# Altium project MJVESC_MINI.PrjPCB
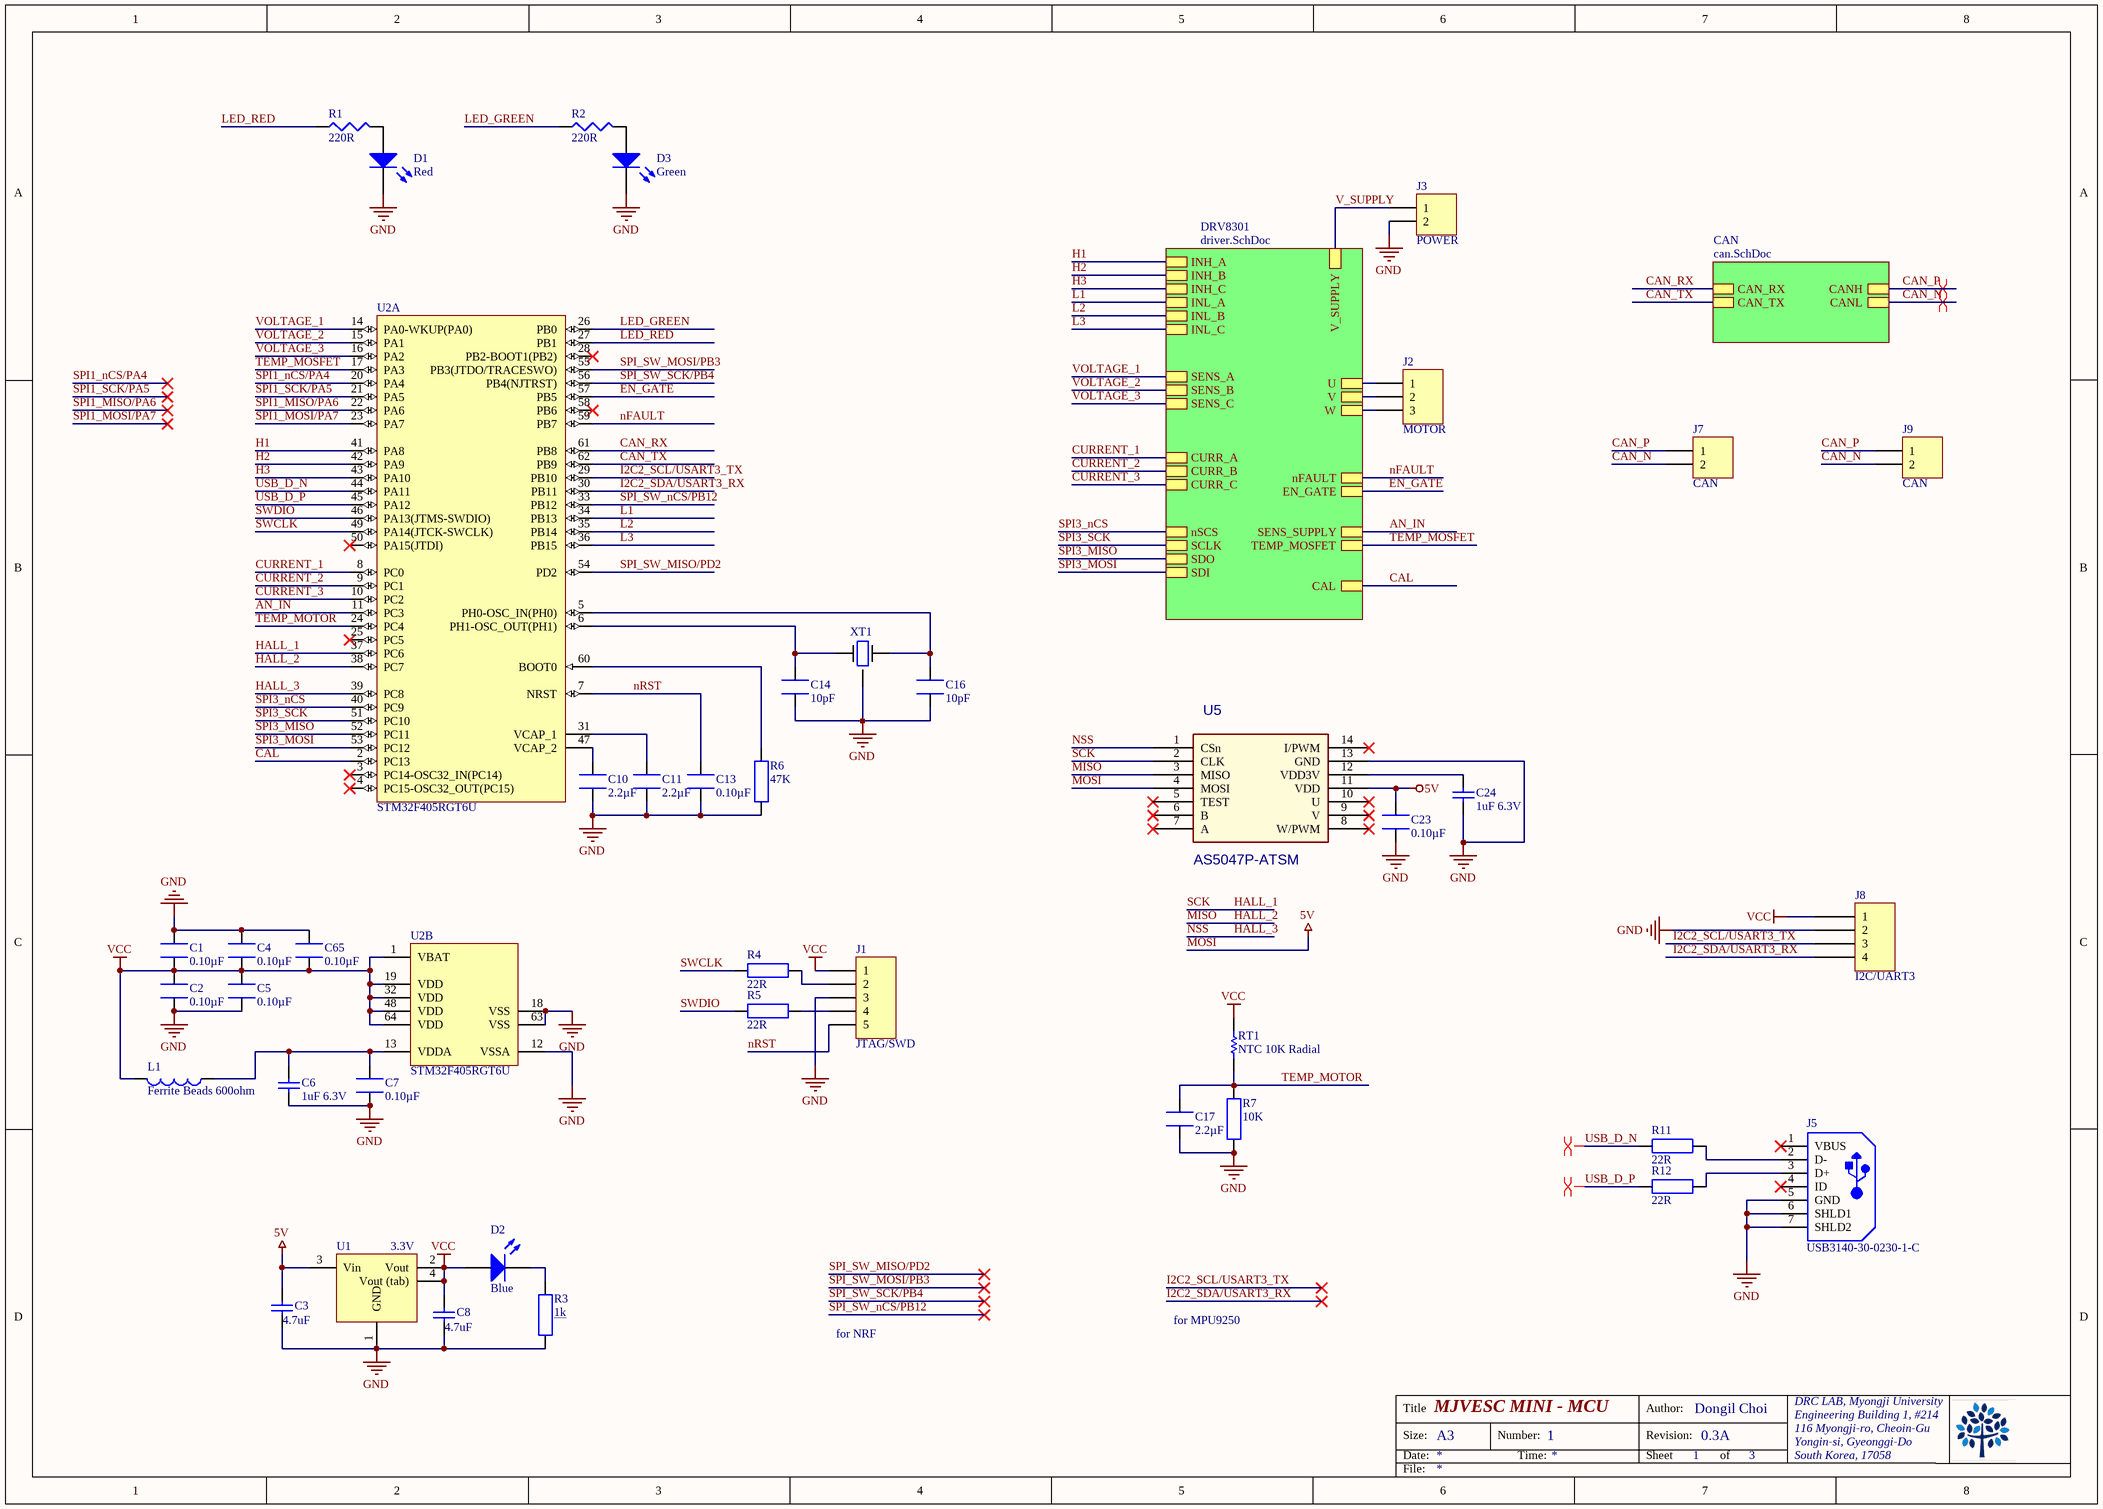
[diagram p0: mcu.SchDoc]
3 sheets, 121 parts. Net scope: hierarchical (ports join the sheet entries above them; power ports are global).
Board file: MJVESC_MINI_CIR_VER03.PcbDoc
Sheets:
  mcu.SchDoc
    CAN = can.SchDoc
    DRV8301 = driver.SchDoc

## Sheet mcu.SchDoc: MJVESC MINI - MCU
size A3; Author: Dongil Choi; Organization: DRC LAB, Myongji University; Address1: Engineering Building 1, #214; Address2: 116 Myongji-ro, Cheoin-Gu; Address3: Yongin-si, Gyeonggi-Do; Address4: South Korea, 17058; DocumentNumber: 1; Revision: 0.3A; SheetNumber: 1; SheetTotal: 3

### Parts
C1  0.10µF  [CAP 0603/1608]
C2  0.10µF  [CAP 0603/1608]
C3  4.7uF  [CAPC0805(2012)145_N]
C4  0.10µF  [CAP 0603/1608]
C5  0.10µF  [CAP 0603/1608]
C6  1uF 6.3V  [CAPC0603(1608)100_N]
C7  0.10µF  [CAP 0603/1608]
C8  4.7uF  [CAPC0805(2012)145_N]
C10  2.2µF  [CAP 0603/1608]
C11  2.2µF  [CAP 0603/1608]
C13  0.10µF  [CAP 0603/1608]
C14  10pF  [CAP 0603/1608]
C16  10pF  [CAP 0603/1608]
C17  2.2µF  [CAP 0603/1608]
C23  0.10µF  [CAP 0603/1608]
C24  1uF 6.3V  [CAPC0603(1608)100_N]
C65  0.10µF  [CAP 0603/1608]
D1  Red  [LED 0603/1608 RED]
D2  Blue  [LED 0603/1608 BLUE]
D3  Green  [LED 0603/1608 GREEN]
J1  JTAG/SWD  [JST BM05B-GHS-TBT]
J2  MOTOR  [MR30PW - MIRROR]
J3  POWER  [XT30PW - MIRROR]
J5  USB3140-30-0230-1-C  [GCT-USB3140_V]
J7  CAN  [JST SM02B-GHS-TB]
J8  I2C/UART3  [JST BM04B-GHS-TBT]
J9  CAN  [JST SM02B-GHS-TB]
L1  Ferrite Beads 600ohm  [FER 0603/1608]
R1  220R  [RES 0603/1608]
R2  220R  [RES 0603/1608]
R3  1k  [RES 0603/1608]
R4  22R  [RES 0603/1608]
R5  22R  [RES 0603/1608]
R6  47K  [RES 0603/1608]
R7  10K  [RES 0603/1608]
R11  22R  [RES 0603/1608]
R12  22R  [RES 0603/1608]
RT1  NTC 10K Radial  [SEMI-103AT-2_V]
U1  3.3V  [SOT-223-2]
U2  STM32F405RGT6U  [STM-LQFP64_V]  (parts A,B of 2)
U5  AS5047P-ATSM  [AMS-TSSOP-14-5000X4400DE_M]
XT1  8 MHz  [DFN220P320X110-4N]  (value not drawn)

### Sub-sheets
CAN = can.SchDoc: CAN_TX, CAN_RX, CANH, CANL
DRV8301 = driver.SchDoc: EN_GATE, SENS_A, SENS_B, INH_A, INL_A, INH_B, INL_B, INH_C, INL_C, SENS_C, SENS_SUPPLY, CURR_C, CURR_B, CURR_A, U, V, W, V_SUPPLY, nSCS, SCLK, SDO, SDI, nFAULT, TEMP_MOSFET, CAL

### Nets
GND: C1.1 C2.2 C3.1 C4.1 C5.2 C6.2 C7.2 C8.1 C10.1 C11.1 C13.1 C14.2 C16.2 C17.1 C23.1 C24.2 C65.1 D1.2(K) D3.2(K) J1.3 J3.2 J5.5(GND) J5.6(SHLD1) J5.7(SHLD2) J8.2 R3.2 R6.1 R7.2 U1.1(GND) U2.12(VSSA) U2.18(VSS) U2.63(VSS) U5.13(GND) XT1.G
MOSI: C3.2 C23.2 U1.3(Vin) U5.4(MOSI) U5.11(VDD)  [also labelled 5V]
V_SUPPLY: J3.1 ; sheet DRV8301/V_SUPPLY
VCC: C1.2 C2.1 C4.2 C5.1 C8.2 C65.2 D2.1(A) J1.1 J8.1 L1.2 RT1.2 U1.2(Vout) U1.4(Vout_(tab)) U2.1(VBAT) U2.19(VDD) U2.32(VDD) U2.48(VDD) U2.64(VDD)
AN_IN: U2.11(PC3) ; sheet DRV8301/SENS_SUPPLY
CAL: U2.2(PC13) ; sheet DRV8301/CAL
CAN_N: J7.2 J9.2 ; sheet CAN/CANL
CAN_P: J7.1 J9.1 ; sheet CAN/CANH
CAN_RX: U2.61(PB8) ; sheet CAN/CAN_RX
CAN_TX: U2.62(PB9) ; sheet CAN/CAN_TX
CURRENT_1: U2.8(PC0) ; sheet DRV8301/CURR_A
CURRENT_2: U2.9(PC1) ; sheet DRV8301/CURR_B
CURRENT_3: U2.10(PC2) ; sheet DRV8301/CURR_C
EN_GATE: U2.57(PB5) ; sheet DRV8301/EN_GATE
H1: U2.41(PA8) ; sheet DRV8301/INH_A
H2: U2.42(PA9) ; sheet DRV8301/INH_B
H3: U2.43(PA10) ; sheet DRV8301/INH_C
HALL_1: U2.37(PC6) U5.2(CLK)  [also labelled SCK]
HALL_2: U2.38(PC7) U5.3(MISO)  [also labelled MISO]
HALL_3: U2.39(PC8) U5.1(CSn)  [also labelled NSS]
I2C2_SCL/USART3_TX: J8.3 U2.29(PB10)
I2C2_SDA/USART3_RX: J8.4 U2.30(PB11)
L1: U2.34(PB13) ; sheet DRV8301/INL_A
L2: U2.35(PB14) ; sheet DRV8301/INL_B
L3: U2.36(PB15) ; sheet DRV8301/INL_C
LED_GREEN: R2.1 U2.26(PB0)
LED_RED: R1.1 U2.27(PB1)
nFAULT: U2.59(PB7) ; sheet DRV8301/nFAULT
nRST: C13.2 J1.5 U2.7(NRST)
SHA: J2.1 ; sheet DRV8301/U
SHB: J2.2 ; sheet DRV8301/V
SHC: J2.3 ; sheet DRV8301/W
SPI1_MISO/PA6: U2.22(PA6)
SPI1_MOSI/PA7: U2.23(PA7)
SPI1_nCS/PA4: U2.20(PA4)
SPI1_SCK/PA5: U2.21(PA5)
SPI3_MISO: U2.52(PC11) ; sheet DRV8301/SDO
SPI3_MOSI: U2.53(PC12) ; sheet DRV8301/SDI
SPI3_nCS: U2.40(PC9) ; sheet DRV8301/nSCS
SPI3_SCK: U2.51(PC10) ; sheet DRV8301/SCLK
SPI_SW_MISO/PD2: U2.54(PD2)
SPI_SW_MOSI/PB3: U2.55(PB3(JTDO/TRACESWO))
SPI_SW_nCS/PB12: U2.33(PB12)
SPI_SW_SCK/PB4: U2.56(PB4(NJTRST))
SWCLK: R4.2 U2.49(PA14(JTCK-SWCLK))
SWDIO: R5.2 U2.46(PA13(JTMS-SWDIO))
TEMP_MOSFET: U2.17(PA3) ; sheet DRV8301/TEMP_MOSFET
TEMP_MOTOR: C17.2 R7.1 RT1.1 U2.24(PC4)
USB_D_N: R11.1 U2.44(PA11)
USB_D_P: R12.1 U2.45(PA12)
VOLTAGE_1: U2.14(PA0-WKUP(PA0)) ; sheet DRV8301/SENS_A
VOLTAGE_2: U2.15(PA1) ; sheet DRV8301/SENS_B
VOLTAGE_3: U2.16(PA2) ; sheet DRV8301/SENS_C
NetC6_1: C6.1 C7.1 L1.1 U2.13(VDDA)
NetC10_2: C10.2 U2.47(VCAP_2)
NetC11_2: C11.2 U2.31(VCAP_1)
NetC14_1: C14.1 U2.6(PH1-OSC_OUT(PH1)) XT1.1
NetC16_1: C16.1 U2.5(PH0-OSC_IN(PH0)) XT1.3
NetC24_1: C24.1 U5.12(VDD3V)
NetD1_1: D1.1(A) R1.2
NetD2_2: D2.2(K) R3.1
NetD3_1: D3.1(A) R2.2
NetJ1_2: J1.2 R4.1
NetJ1_4: J1.4 R5.1
NetJ5_2: J5.2(D-) R11.2
NetJ5_3: J5.3(D+) R12.2
NetR6_2: R6.2 U2.60(BOOT0)

Not connected (* = marked no-connect by the designer): J5 1(VBUS)* 4(ID)*; U2 3(PC14-OSC32_IN(PC14))* 4(PC15-OSC32_OUT(PC15))* 25(PC5)* 28(PB2-BOOT1(PB2))* 50(PA15(JTDI))* 58(PB6)*; U5 5(TEST)* 6(B)* 7(A)* 8(W/PWM)* 9(V)* 10(U)* 14(I/PWM)*

### Layout directives
differential pair: CAN_N, CAN_P, USB_D_N, USB_D_P

### Notes on the sheet
- for MPU9250
- for NRF
- Title
- Size:
- Date:
- A3
- Number:
- Time:
- Revision:
- Sheet
- Author:
- of
- File:

### Library data of the parts
C1 C2 C4 C5 C7 C13 C23 C65 = GRM188R71E104KA01D: CAP CER 0.1UF 25V X7R 0603; Manufacturer: Murata Electronics North America; Tolerance: ±10%; Supplier 1: Digi-Key; Supplier Part Number 1: 490-1524-1-ND; Manufacturer Part Number: GRM188R71E104KA01D; RoHS: RoHS Compliant; Category: Capacitors; Stock 1: 1667481; Pricing 1: 1=0.1, 10=0.019, 50=0.0104, 100=0.0088, 250=0.0072, 500=0.00616, 1000=0.0048 (USD); Packaging: Cut Tape (CT); Capacitance: 0.10µF; Voltage - Rated: 25V; Temperature Coefficient: X7R; Mounting Type: Surface Mount, MLCC; Operating Temperature: -55°C ~ 125°C; Applications: General Purpose; Ratings: -; Package / Case: 0603 (1608 Metric); Size / Dimension: 0.063" L x 0.031" W (1.60mm x 0.80mm); Height - Seated (Max): -; Thickness (Max): 0.035" (0.90mm); Lead Spacing: -; Features: -; Lead Style: -; ComponentLink1URL: http://www.murata.com/~/media/webrenewal/support/library/catalog/products/capacitor/mlcc/c02e.pdf; ComponentLink1Description: http://www.murata.com/~/media/webrenewal/support/library/catalog/products/capacitor/mlcc/c02e.pdf; PartNumber: GRM188R71E104KA01D
C3 C8 = CMP-1036-04898-1: CAP 4.7uF 35V ±10% 0805 (2012 Metric) Thickness 1.45mm SMD; PartNumber: GRM219R6YA475KA73D; Case-Metric: 2012; Tolerance: Â±10%; Case-EIA: 0805; Max Thickness: 1.45 mm; Technology: SMT; Value: 4.7uF; Rated Voltage: 35 V
C6 C24 = CMP-1035-02730-1: CAP 1uF 6.3V ±10% 0603 (1608 Metric) Thickness 1mm SMD; PartNumber: CC0603KRX7R5BB105; Case-EIA: 0603; Case-Metric: 1608; Tolerance: Â±10%; Rated Voltage: 6.3 V; Max Thickness: 1 mm; Technology: SMT; Value: 1uF
C10 C11 C17 = GRM188R61C225KE15D: CAP CER 2.2UF 16V X5R 0603; Manufacturer: Murata Electronics North America; Tolerance: ±10%; Supplier 1: Digi-Key; Supplier Part Number 1: 490-3296-1-ND; Manufacturer Part Number: GRM188R61C225KE15D; RoHS: RoHS Compliant; Category: Capacitors; Stock 1: 1255740; Pricing 1: 1=0.12, 10=0.08, 50=0.046, 100=0.038, 250=0.032, 500=0.0268, 1000=0.022 (USD); Packaging: Cut Tape (CT); Capacitance: 2.2µF; Voltage - Rated: 16V; Temperature Coefficient: X5R; Mounting Type: Surface Mount, MLCC; Operating Temperature: -55°C ~ 85°C; Applications: General Purpose; Ratings: -; Package / Case: 0603 (1608 Metric); Size / Dimension: 0.063" L x 0.031" W (1.60mm x 0.80mm); Height - Seated (Max): -; Thickness (Max): 0.035" (0.90mm); Lead Spacing: -; Features: -; Lead Style: -; ComponentLink1URL: http://www.murata.com/~/media/webrenewal/support/library/catalog/products/capacitor/mlcc/c02e.pdf; ComponentLink1Description: http://www.murata.com/~/media/webrenewal/support/library/catalog/products/capacitor/mlcc/c02e.pdf; PartNumber: GRM188R61C225KE15D
C14 C16 = GRM1885C1H100JA01D: CAP CER 10PF 50V NP0 0603; Manufacturer: Murata Electronics North America; Tolerance: ±5%; Temperature Coefficient: C0G, NP0; Supplier 1: Digi-Key; Supplier Part Number 1: 490-1403-1-ND; Manufacturer Part Number: GRM1885C1H100JA01D; RoHS: RoHS Compliant; Category: Capacitors; Stock 1: 450321; Pricing 1: 1=0.1, 10=0.041, 50=0.0222, 100=0.0187, 250=0.01532, 500=0.0131, 1000=0.0102 (USD); Packaging: Cut Tape (CT); Capacitance: 10pF; Voltage - Rated: 50V; Mounting Type: Surface Mount, MLCC; Operating Temperature: -55°C ~ 125°C; Applications: General Purpose; Ratings: -; Package / Case: 0603 (1608 Metric); Size / Dimension: 0.063" L x 0.031" W (1.60mm x 0.80mm); Height - Seated (Max): -; Thickness (Max): 0.035" (0.90mm); Lead Spacing: -; Features: -; Lead Style: -; ComponentLink1URL: http://www.murata.com/~/media/webrenewal/support/library/catalog/products/capacitor/mlcc/c02e.pdf; ComponentLink1Description: http://www.murata.com/~/media/webrenewal/support/library/catalog/products/capacitor/mlcc/c02e.pdf; PartNumber: GRM1885C1H100JA01D
D1 = LED0: Typical INFRARED GaAs LED; PartNumber: LTST-C191KRKT; Published: 8-Jun-2000; LatestRevisionDate: 08-Jul-2005; LatestRevisionNote: Mech Layer 1 removed.; PackageReference: LED-0; Publisher: Altium Limited; PackageDescription: LED; 2 Leads
D2 = LED0: Typical INFRARED GaAs LED; PartNumber: LTST-C191TBKT; Published: 8-Jun-2000; LatestRevisionDate: 08-Jul-2005; LatestRevisionNote: Mech Layer 1 removed.; PackageReference: LED-0; Publisher: Altium Limited; PackageDescription: LED; 2 Leads
D3 = LED0: Typical INFRARED GaAs LED; PartNumber: LTST-C191KGKT; Published: 8-Jun-2000; LatestRevisionDate: 08-Jul-2005; LatestRevisionNote: Mech Layer 1 removed.; PackageReference: LED-0; Publisher: Altium Limited; PackageDescription: LED; 2 Leads
J1 = JST BM05B-GHS-TBT: JST GH Connector, 5Pin, Vertical; LatestRevisionDate: 17-Jul-2002; LatestRevisionNote: Re-released for DXP Platform.; Publisher: Altium Limited; PartNumber: BM05B-GHS-TBT
J2 = MR30PW-M: AMASS, MR30,  on PCBs, 30A 500V, UL94V, -20...120°C; Parameter 1: XT30PW-M; LatestRevisionDate: 17-Jul-2002; LatestRevisionNote: Re-released for DXP Platform.; Publisher: Altium Limited
J3 = XT30PW-M: AMASS, XT30,  on PCBs, 30A 500V, UL94V, -20...120°C; LatestRevisionDate: 17-Jul-2002; LatestRevisionNote: Re-released for DXP Platform.; Publisher: Altium Limited; Parameter 1: XT30PW-M
J5 = CMP-2000-07368-1: Micro USB Receptacle, Type B, SMT, Vertical, with Through-Hole Shell Stakes, -30 to 85 degC, 5-Pin SMD, RoHS, Tape and Reel; Manufacturer: Global Connector Technology; Connector Mounting: PCB; SVHC: NoSVHC(19-Dec-2012); No. of Positions: 5; Connector Type: USB2.0MicroB; No. of Rows: 1; Contact Termination: SurfaceMountVertical; Pitch: 0.65mm; Contact Material: Copper; Gender: Receptacle; PartNumber: USB3140; Series: USB3140; Datasheet URL: http://www.farnell.com/datasheets/1913332.pdf; Contact Plating: Gold; Manufacturer URL: http://gct.co/; Package Reference: USB3140; No. of Contacts: 5; Orientation: Vertical; Datasheet Version: Rev. B2, 04/2015; Package Description: 5-Pin Surface Mount Device, Body 7.8 x 4 mm, Pitch 0.65 mm; Mounting Technology: SurfaceMount
J7 J9 = JST SM02B-GH: JST GH Connector, 2Pin; PartNumber: SM02B-GHS-TB(LF)(SN); LatestRevisionDate: 17-Jul-2002; LatestRevisionNote: Re-released for DXP Platform.; Publisher: Altium Limited
J8 = JST BM04B-GH: JST GH Connector, 4Pin; PartNumber: BM04B-GHS-TB(LF)(SN)
L1 = Inductor: Ferrite Beads 600MHz 0.015Ohm 25% 1608 AEC-Q200; PartNumber: KPZ1608SHR601ATD25; Code_IEC: 1005; Value: 10mH; Published: 8-Jun-2000; LatestRevisionDate: 29-May-2009; LatestRevisionNote: IPC-7351 Footprint Added.; PackageReference: 0402-A; Publisher: Altium Limited; PackageDescription: Chip Inductor; Code_JEITA: 0402
R1 R2 = Res3: RES SMD 220R OHM 1% 1/10W 0603; PartNumber: RC0603FR-10220RL; Published: 8-Jun-2000; LatestRevisionDate: 29-May-2009; LatestRevisionNote: IPC-7351 Footprint Added.; PackageReference: J1-0603; Publisher: Altium Limited; PackageDescription: Chip Resistor; Value: 220R
R3 = RC0603FR-071KL: RES SMD 1K OHM 1% 1/10W 0603; Manufacturer: Yageo; Power (Watts): 0.1W, 1/10W; Temperature Coefficient: ±100ppm/°C; Supplier 1: Digi-Key; Supplier Part Number 1: 311-1.00KHRCT-ND; RoHS: RoHS Compliant; Category: Resistors; Stock 1: 6734836; Pricing 1: 1=0.1, 10=0.014, 25=0.01, 100=0.0057, 250=0.00436, 500=0.00348, 1000=0.00257, 2500=0.00223 (USD); Packaging: Cut Tape (CT); Tolerance: ±1%; Composition: Thick Film; Features: Moisture Resistant; Operating Temperature: -55°C ~ 155°C; Package / Case: 0603 (1608 Metric); Supplier Device Package: 0603; Size / Dimension: 0.063" L x 0.031" W (1.60mm x 0.80mm); Height: 0.022" (0.55mm); Number of Terminations: 2; ComponentLink1URL: http://www.yageo.com/documents/recent/PYu-RC_Group_51_RoHS_L_04.pdf; ComponentLink1Description: http://www.yageo.com/documents/recent/PYu-RC_Group_51_RoHS_L_04.pdf; Manufacturer Part Number: RC0603FR-071KL; Resistance (Ohms): 1k; PartNumber: RC0603FR-071KL
R4 R5 R11 R12 = RC0603FR-0722RL: RES SMD 22 OHM 1% 1/10W 0603; Manufacturer: Yageo; Resistance (Ohms): 22; Power (Watts): 0.1W, 1/10W; Temperature Coefficient: ±100ppm/°C; Supplier 1: Digi-Key; Supplier Part Number 1: 311-22.0HRCT-ND; Manufacturer Part Number: RC0603FR-0722RL; RoHS: RoHS Compliant; Category: Resistors; Stock 1: 575303; Pricing 1: 1=0.1, 10=0.014, 25=0.01, 100=0.0057, 250=0.00436, 500=0.00348, 1000=0.00257, 2500=0.00223 (USD); Packaging: Cut Tape (CT); Tolerance: ±1%; Composition: Thick Film; Features: Moisture Resistant; Operating Temperature: -55°C ~ 155°C; Package / Case: 0603 (1608 Metric); Supplier Device Package: 0603; Size / Dimension: 0.063" L x 0.031" W (1.60mm x 0.80mm); Height: 0.022" (0.55mm); Number of Terminations: 2; ComponentLink1URL: http://www.yageo.com/documents/recent/PYu-RC_Group_51_RoHS_L_04.pdf; ComponentLink1Description: http://www.yageo.com/documents/recent/PYu-RC_Group_51_RoHS_L_04.pdf; PartNumber: RC0603FR-0722RL
R6 = RC0603FR-0747KL: RES SMD 47K OHM 1% 1/10W 0603; Manufacturer: Yageo; Power (Watts): 0.1W, 1/10W; Temperature Coefficient: ±100ppm/°C; Supplier 1: Digi-Key; Supplier Part Number 1: 311-47.0KHRCT-ND; Manufacturer Part Number: RC0603FR-0747KL; RoHS: RoHS Compliant; Category: Resistors; Stock 1: 930868; Pricing 1: 1=0.1, 10=0.014, 25=0.01, 100=0.0057, 250=0.00436, 500=0.00348, 1000=0.00257, 2500=0.00223 (USD); Packaging: Cut Tape (CT); Resistance (Ohms): 47k; Tolerance: ±1%; Composition: Thick Film; Features: Moisture Resistant; Operating Temperature: -55°C ~ 155°C; Package / Case: 0603 (1608 Metric); Supplier Device Package: 0603; Size / Dimension: 0.063" L x 0.031" W (1.60mm x 0.80mm); Height: 0.022" (0.55mm); Number of Terminations: 2; ComponentLink1URL: http://www.yageo.com/documents/recent/PYu-RC_Group_51_RoHS_L_04.pdf; ComponentLink1Description: http://www.yageo.com/documents/recent/PYu-RC_Group_51_RoHS_L_04.pdf; PartNumber: RC0603FR-0747KL
R7 = RC0603FR-0710KL: RES SMD 10K OHM 1% 1/10W 0603; Manufacturer: Yageo; Power (Watts): 0.1W, 1/10W; Temperature Coefficient: ±100ppm/°C; Supplier 1: Digi-Key; Supplier Part Number 1: 311-10.0KHRCT-ND; Manufacturer Part Number: RC0603FR-0710KL; RoHS: RoHS Compliant; Category: Resistors; Stock 1: 13504930; Pricing 1: 1=0.1, 10=0.014, 25=0.01, 100=0.0057, 250=0.00436, 500=0.00348, 1000=0.00257, 2500=0.00223 (USD); Packaging: Cut Tape (CT); Resistance (Ohms): 10k; Tolerance: ±1%; Composition: Thick Film; Features: Moisture Resistant; Operating Temperature: -55°C ~ 155°C; Package / Case: 0603 (1608 Metric); Supplier Device Package: 0603; Size / Dimension: 0.063" L x 0.031" W (1.60mm x 0.80mm); Height: 0.022" (0.55mm); Number of Terminations: 2; ComponentLink1URL: http://www.yageo.com/documents/recent/PYu-RC_Group_51_RoHS_L_04.pdf; ComponentLink1Description: http://www.yageo.com/documents/recent/PYu-RC_Group_51_RoHS_L_04.pdf; PartNumber: RC0603FR-0710KL
RT1 = CMP-2000-05824-1: NTC Thermistors 10Kohms 5% Radial / NTCLE100E3103JT2 (Vishay - cheap); Brand: Semitec; Tolerance: 1%; Packaging: Bulk; Mounting Technology: ThroughHole; Operating Temperature Range: -50Cto+110C; Lead Spacing: 2.54mm; RoHS: True; Manufacturer URL: http://www.semitec.co.jp/english/; Datasheet Version: Rev. A, 02/2007; Length: 17mm; Manufacturer: Semitec; Resistance: 10kOhms; Termination Style: Radial; Datasheet URL: https://www.rapidonline.com/pdf/61-0500e.pdf; Product Category: Thermistors-NTC; Series: AT; Package Description: 2-Pin Through Hole Device, Body Width 3.8 mm (Max), Pitch 2.54 mm; Width: 3.7mm; Type: NTC; Package Reference: 103AT-2; Height: 2.4mm; PartNumber: NTCLE100E3103JT2
U1 = AZ1117EH-3.3TRG1: IC REG LDO 3.3V 1A SOT223; Manufacturer: Diodes Incorporated; Regulator Topology: Positive Fixed; Voltage - Dropout (Typical): 1.1V @ 1A; Voltage - Input: Up to 13V; Supplier 1: Digi-Key; Supplier Part Number 1: AZ1117EH-3.3TRG1DICT-ND; RoHS: RoHS Compliant; Category: Integrated Circuits (ICs); Stock 1: 22748; Pricing 1: 1=0.43, 10=0.321, 100=0.1815, 500=0.12022, 1000=0.09216 (USD); Packaging: Cut Tape (CT); Part Status: Active; Voltage - Output: 3.3V; Current - Output: 1A; Current - Limit (Min): -; Operating Temperature: -40°C ~ 125°C; Mounting Type: Surface Mount; Package / Case: TO-261-4, TO-261AA; Supplier Device Package: SOT-223; ComponentLink1URL: http://www.diodes.com/assets/Datasheets/AZ1117E.pdf; ComponentLink1Description: http://www.diodes.com/assets/Datasheets/AZ1117E.pdf; PartNumber: AZ1117EH-3.3TRG1
U2 = STM32F405RGT6: ARM Cortex-M4 32-bit MCU+FPU, 210 DMIPS, 1024 kB Flash, 192 kB Internal RAM, 51 I/Os, 64-pin LQFP, -40 to 85 degC, Tray; Manufacturer: STMicroelectronics; Operating Frequency(F) (Processor speed) (MHz): 168; Internal RAM Size (kB): 192; FLASH Size (Prog) (kB): 1024; Supply Voltage(Vcc) min (V): 1.8; I/Os (High Current): 51; D/A Converter: 2x12-bit; Supply Voltage(Vcc) max (V): 3.6; ComponentLink1Description: Manufacturer URL; PackageDescription: 64-Pin Low Profile Quad Flat Package, 10 x 10 mm Body, 0.5 mm Pitch; Mounting Technology: Surface Mount; ComponentLink2URL: http://www.st.com/st-web-ui/static/active/en/resource/technical/document/datasheet/DM00037051.pdf; ComponentLink1URL: http://www.st.com/web/en/home.html; PartNumber: STM32F405RGT6U; ComponentLink2Description: Datasheet; ComponentLink3URL: http://www.st.com/st-web-ui/static/active/en/resource/technical/document/datasheet/DM00037051.pdf; Core: ARM Cortex-M4; PackageReference: LQFP64; ComponentLink3Description: Package Specification; DatasheetVersion: Rev. 4; Packing: Tray; PackageVersion: Rev. 4, 06/2013
U5 = AS5147: AS5147-HTSM; PartNumber: AS5047P-ATSM
XT1 = ABM3B-8.000MHZ-10-1-U-T: Crystal 8MHz ±10ppm 10pF 200 Ohm -10°C ~ 60°C Surface Mount 4-SMD, No Lead (DFN, LCC); PartNumber: ABM3B-8.000MHZ-10-1UT

## Sheet can.SchDoc: MJVESC MINI - CAN
size A4; Author: Dongil Choi; Organization: DRC LAB, Myongji University; Address1: Engineering Building 1, #214; Address2: 116 Myongji-ro, Cheoin-Gu; Address3: Yongin-si, Gyeonggi-Do; Address4: South Korea, 17058; DocumentNumber: 3; Revision: 0.3A; SheetNumber: 3; SheetTotal: 3
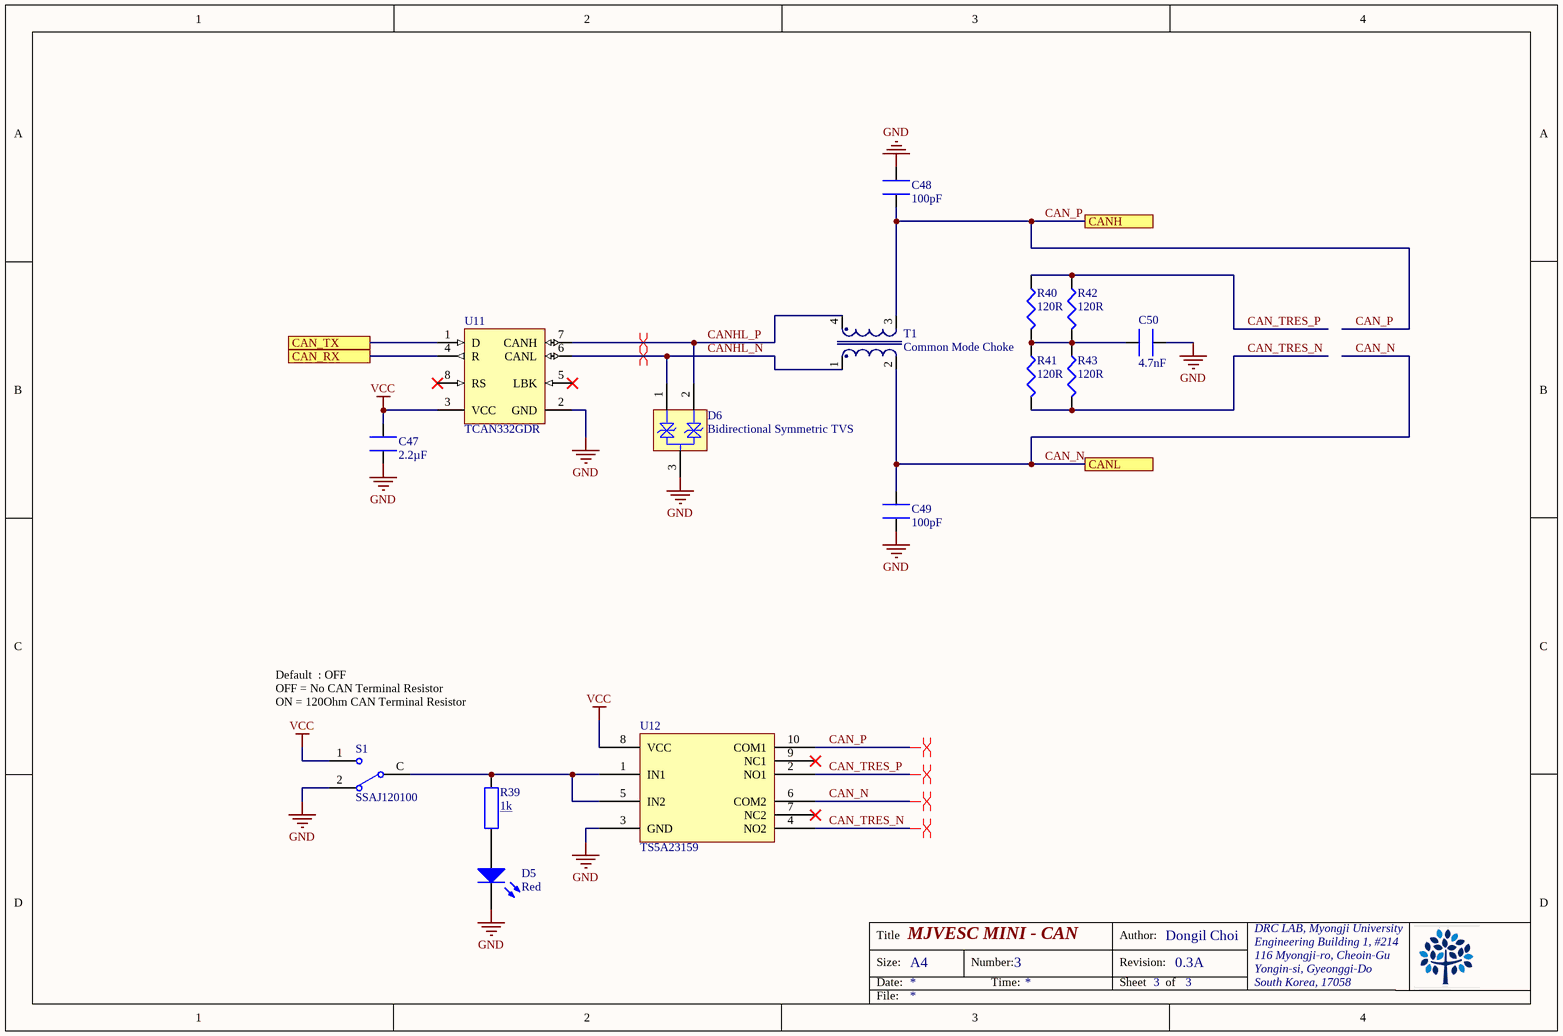
[diagram p1: can.SchDoc]

### Parts
C47  2.2µF  [CAP 0603/1608]
C48  100pF  [CAP 0402/1005]
C49  100pF  [CAP 0402/1005]
C50  4.7nF  [CAP 0603/1608]
D5  Red  [LED 0603/1608 RED]
D6  Bidirectional Symmetric TVS  [SOT23-3L]
R39  1k  [RES 0603/1608]
R40  120R  [RES 0603/1608]
R41  120R  [RES 0603/1608]
R42  120R  [RES 0603/1608]
R43  120R  [RES 0603/1608]
S1  SSAJ120100  [SSAJ120100]
T1  Common Mode Choke  [SRF4532-101Y]
U11  TCAN332GDR  [D0008A_N]
U12  TS5A23159  [RSE10]

### Ports
CAN_RX, CAN_TX, CANH, CANL

### Nets
GND: C47.1 C48.1 C49.2 C50.2 D5.2(K) D6.3(C) S1.2 U11.2(GND) U12.3(GND)
VCC: C47.2 S1.1 U11.3(VCC) U12.8(VCC)
CAN_N: C49.1 T1.2 U12.6(COM2) ; port CANL
CAN_P: C48.2 T1.3 U12.10(COM1) ; port CANH
CAN_RX: U11.4(R) ; port CAN_RX
CAN_TRES_N: R41.2 R43.2 U12.4(NO2)
CAN_TRES_P: R40.1 R42.1 U12.2(NO1)
CAN_TX: U11.1(D) ; port CAN_TX
CANHL_N: D6.1(C) T1.1 U11.6(CANL)
CANHL_P: D6.2(C) T1.4 U11.7(CANH)
NetC50_1: C50.1 R40.2 R41.1 R42.2 R43.1
NetD5_1: D5.1(A) R39.2
NetR39_1: R39.1 S1.C U12.1(IN1) U12.5(IN2)

Not connected (* = marked no-connect by the designer): U11 5(LBK)* 8(RS)*; U12 7(NC2)* 9(NC1)*

### Layout directives
differential pair: CAN_N, CAN_P, CAN_TRES_N, CAN_TRES_P, CANHL_N, CANHL_P

### Notes on the sheet
- Default  : OFF
  OFF = No CAN Terminal Resistor
  ON = 120Ohm CAN Terminal Resistor
- Title
- Size:
- Date:
- A4
- Number:
- Time:
- Revision:
- Sheet
- Author:
- of
- File:

### Library data of the parts
C47 = GRM188R61C225KE15D: as C10 on sheet mcu; Supplier 1: Digi-Key; Supplier Part Number 1: 490-3296-1-ND; Manufacturer Part Number: GRM188R61C225KE15D; RoHS: RoHS Compliant; Category: Capacitors; Stock 1: 1255740; Pricing 1: 1=0.12, 10=0.08, 50=0.046, 100=0.038, 250=0.032, 500=0.0268, 1000=0.022 (USD); Packaging: Cut Tape (CT); Capacitance: 2.2µF; Voltage - Rated: 16V; Temperature Coefficient: X5R; Mounting Type: Surface Mount, MLCC; Operating Temperature: -55°C ~ 85°C; Applications: General Purpose; Ratings: -; Package / Case: 0603 (1608 Metric); Size / Dimension: 0.063" L x 0.031" W (1.60mm x 0.80mm); Height - Seated (Max): -; Thickness (Max): 0.035" (0.90mm); Lead Spacing: -; Features: -; Lead Style: -; ComponentLink1URL: http://www.murata.com/~/media/webrenewal/support/library/catalog/products/capacitor/mlcc/c02e.pdf; ComponentLink1Description: http://www.murata.com/~/media/webrenewal/support/library/catalog/products/capacitor/mlcc/c02e.pdf; PartNumber: GRM188R61C225KE15D
C48 C49 = GRM1885C1H222JA01D: CAP CER 100pF 50V NP0 0402; PartNumber: GRM1555C1H101GA01D
C50 = GRM1885C1H222JA01D: CAP CER 4.7nF 50V NP0 0603; PartNumber: GRM1887U1H472JA01D
D5 = LED0: as D1 on sheet mcu; Published: 8-Jun-2000; LatestRevisionDate: 08-Jul-2005; LatestRevisionNote: Mech Layer 1 removed.; PackageReference: LED-0; Publisher: Altium Limited; PackageDescription: LED; 2 Leads
D6 = ESD8V0L2B-03L: Bi-directional Low Capacitance TVS Diode, -55 to 125 degC, TSLP-3-1, Reel, Green; PartNumber: VCAN26A2-03S-E3-08
R39 = RC0603FR-071KL: as R3 on sheet mcu; Supplier 1: Digi-Key; Supplier Part Number 1: 311-1.00KHRCT-ND; RoHS: RoHS Compliant; Category: Resistors; Stock 1: 6734836; Pricing 1: 1=0.1, 10=0.014, 25=0.01, 100=0.0057, 250=0.00436, 500=0.00348, 1000=0.00257, 2500=0.00223 (USD); Packaging: Cut Tape (CT); Tolerance: ±1%; Composition: Thick Film; Features: Moisture Resistant; Operating Temperature: -55°C ~ 155°C; Package / Case: 0603 (1608 Metric); Supplier Device Package: 0603; Size / Dimension: 0.063" L x 0.031" W (1.60mm x 0.80mm); Height: 0.022" (0.55mm); Number of Terminations: 2; ComponentLink1URL: http://www.yageo.com/documents/recent/PYu-RC_Group_51_RoHS_L_04.pdf; ComponentLink1Description: http://www.yageo.com/documents/recent/PYu-RC_Group_51_RoHS_L_04.pdf; Manufacturer Part Number: RC0603FR-071KL; Resistance (Ohms): 1k; PartNumber: RC0603FR-071KL
R40-R43 = Res3: RES SMD 120R OHM 1% 1/10W 0603; PartNumber: RC0603FR-07120RL; Published: 8-Jun-2000; LatestRevisionDate: 29-May-2009; LatestRevisionNote: IPC-7351 Footprint Added.; PackageReference: J1-0603; Publisher: Altium Limited; PackageDescription: Chip Resistor; Value: 120R
S1 = SW-SPDT: SPDT Subminiature Toggle Switch, Right Angle Mounting, Vertical Actuation; Published: 24-Mar-1999; LatestRevisionDate: 17-Dec-2003; LatestRevisionNote: Schematic revised, PCB Footprint replaced.; DatasheetVersion: 05-Dec-2000; PackageReference: TL36WW15050; Publisher: Altium Limited; PackageDescription: Switch; 4 Leads; ComponentLink1Description: Manufacturer Link; ComponentLink1URL: http://www.apem.com; PartNumber: SSAJ120100
T1 = MID-D11, 070-5627: Dual Coil - Common Mode Choke, 4-Terminal, THT, MID-D11, Bobbin-070-5627; PartNumber: SRF4532-101Y
U11 = TCAN332GDR: 3.3V CAN Transceiver, 5Mbps; Manufacturer: Texas Instruments; Drivers Per Package: 1; Eco-Plan: Green (RoHS & no Sb/Br); Supply Voltage(s)(V): 3.3; Transient Pulse Protection(V): -100 to 100; PackageReference: D0008A; ComponentLink1Description: Datasheet; PackageDescription: 8-Pin Plastic Small Outline Integrated Circuit, 4.9 x 3.9 mm, Pitch 1.27 mm Pitch; SubFamily: CAN; ComponentLink1URL: http://www.ti.com/general/docs/lit/getliterature.tsp?genericPartNumber=SN65HVD233&fileType=pdf; PartNumber: TCAN332GDR; Mounting Technology: Surface Mount
U12 = TI TS5A23159: 1-Ω 2-Channel SPDT Analog Switch; PartNumber: TS5A23159RSER

## Sheet driver.SchDoc: MJVESC MINI - Driver
size A3; Author: Dongil Choi; Organization: DRC LAB, Myongji University; Address1: Engineering Building 1, #214; Address2: 116 Myongji-ro, Cheoin-Gu; Address3: Yongin-si, Gyeonggi-Do; Address4: South Korea, 17058; DocumentNumber: 2; Revision: 0.3A; SheetNumber: 2; SheetTotal: 3
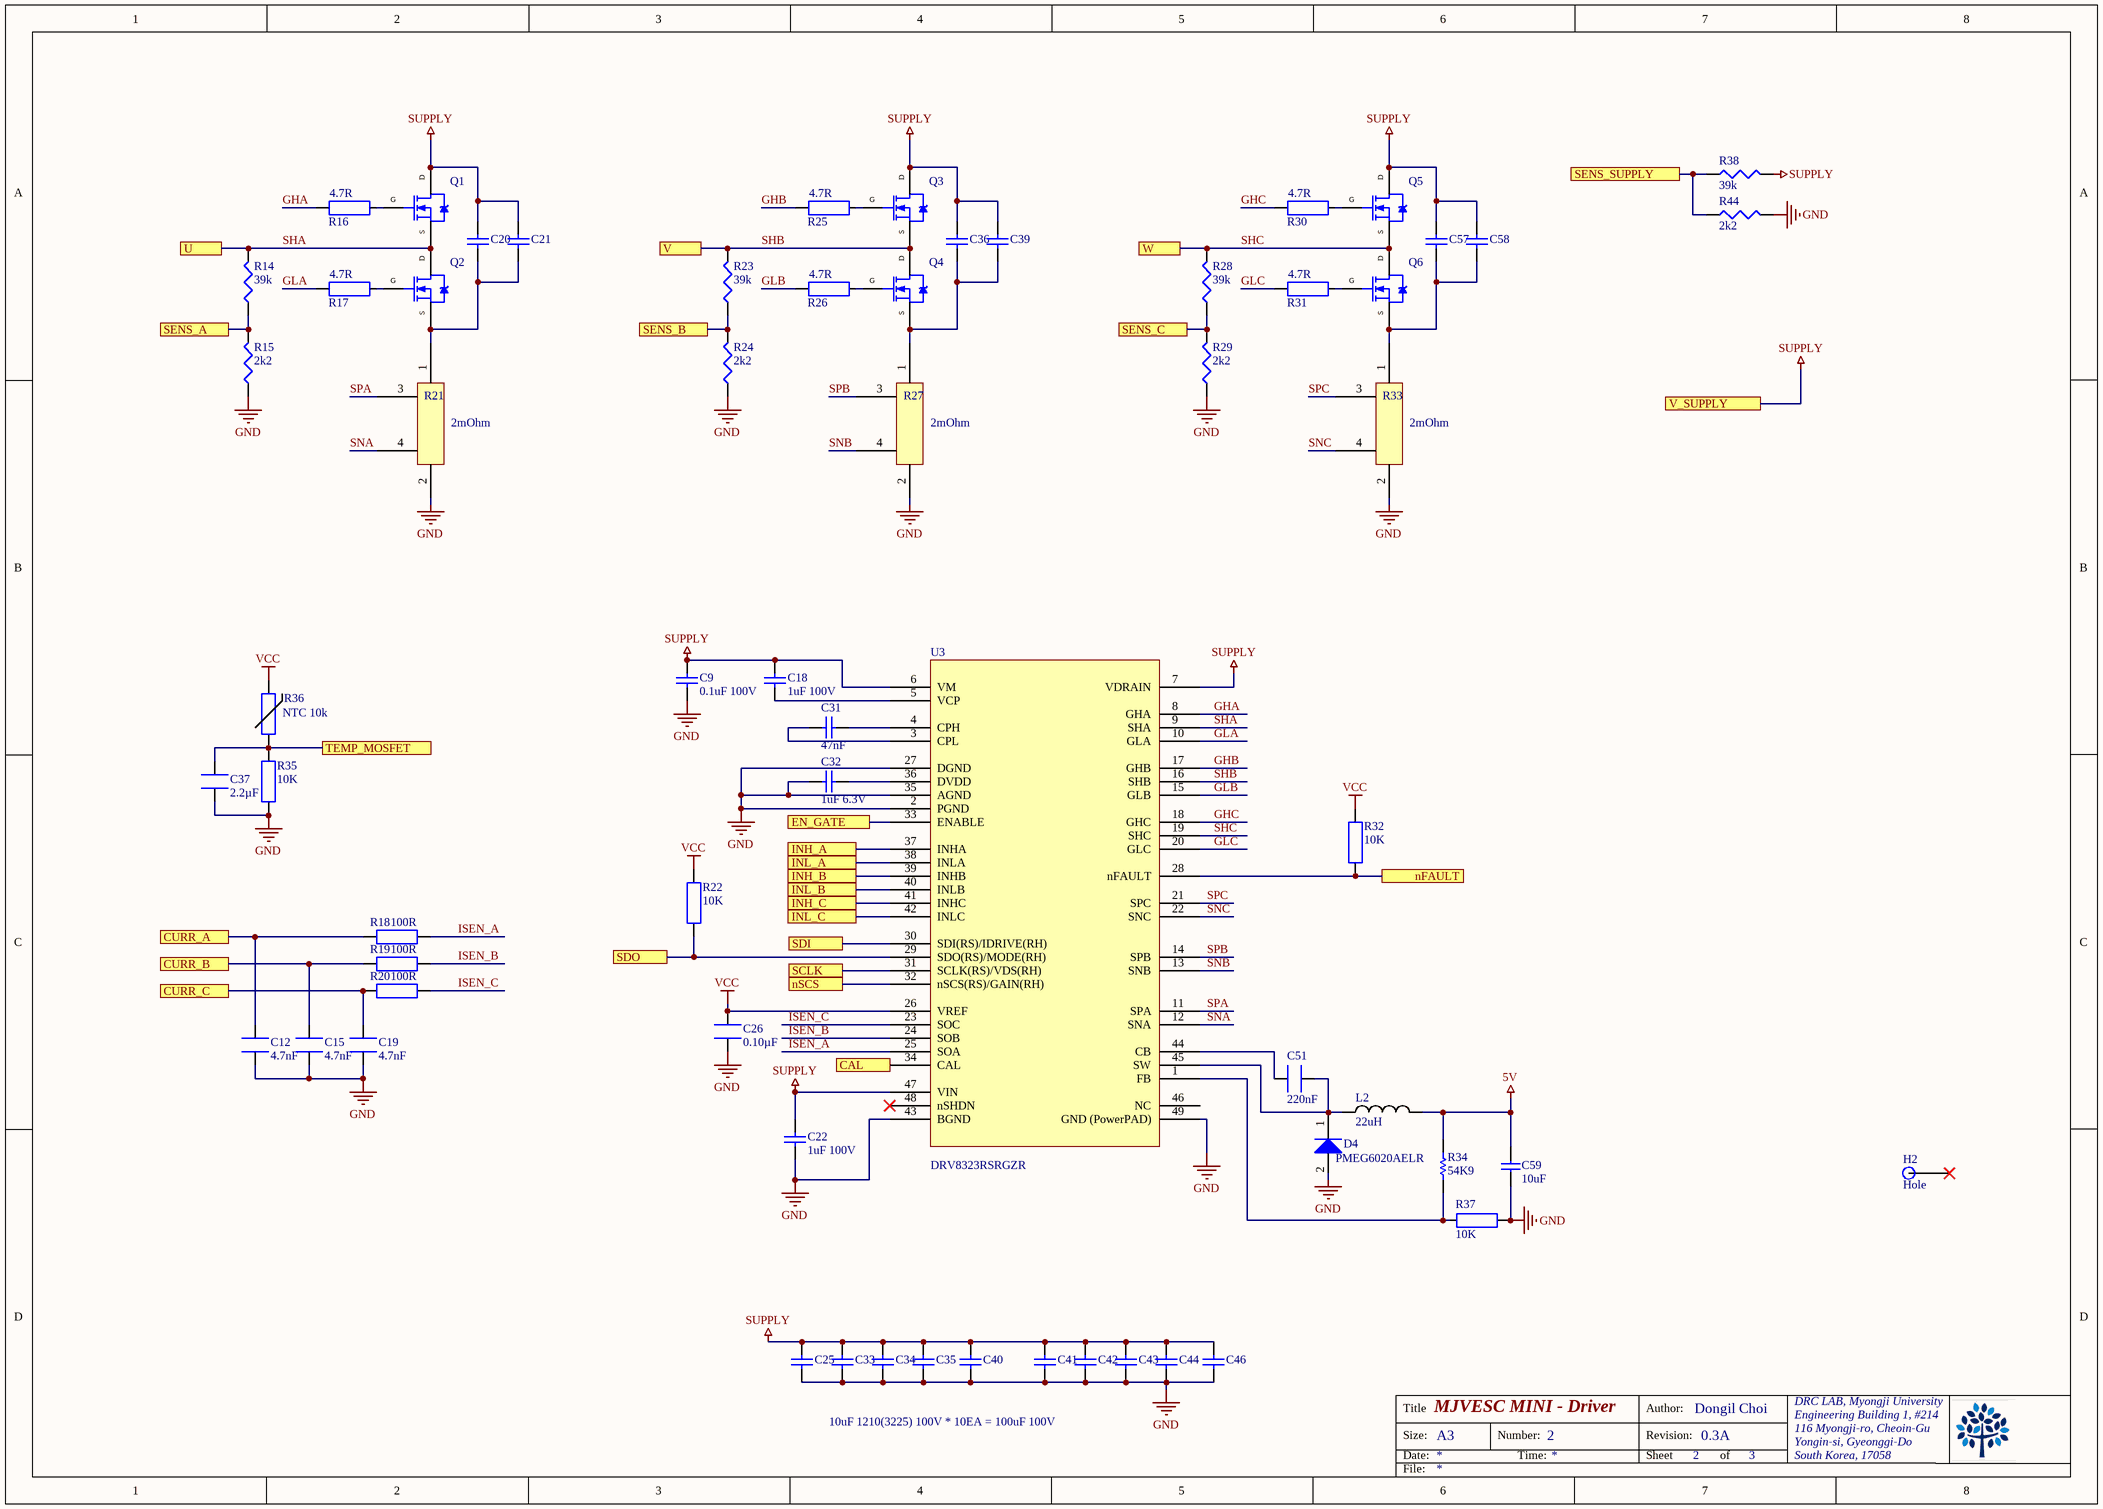
[diagram p2: driver.SchDoc]

### Parts
C9  0.1uF 100V  [CAP 0603/1608]
C12  4.7nF  [CAP 0603/1608]
C15  4.7nF  [CAP 0603/1608]
C18  1uF 100V  [C0805]
C19  4.7nF  [CAP 0603/1608]
C20  CAP 10uF 100V 1210(3225)  [CAPC1210(3225)280_N]  (value not drawn)
C21  CAP 10uF 100V 1210(3225)  [CAPC1210(3225)280_N]  (value not drawn)
C22  1uF 100V  [C0805]
C25  CAP 10uF 100V 1210(3225)  [CAPC1210(3225)280_N]  (value not drawn)
C26  0.10µF  [CAP 0603/1608]
C31  47nF  [CAPC0603(1608)100_L]
C32  1uF 6.3V  [CAPC0603(1608)100_N]
C33  CAP 10uF 100V 1210(3225)  [CAPC1210(3225)280_N]  (value not drawn)
C34  CAP 10uF 100V 1210(3225)  [CAPC1210(3225)280_N]  (value not drawn)
C35  CAP 10uF 100V 1210(3225)  [CAPC1210(3225)280_N]  (value not drawn)
C36  CAP 10uF 100V 1210(3225)  [CAPC1210(3225)280_N]  (value not drawn)
C37  2.2µF  [CAP 0603/1608]
C39  CAP 10uF 100V 1210(3225)  [CAPC1210(3225)280_N]  (value not drawn)
C40  CAP 10uF 100V 1210(3225)  [CAPC1210(3225)280_N]  (value not drawn)
C41  CAP 10uF 100V 1210(3225)  [CAPC1210(3225)280_N]  (value not drawn)
C42  CAP 10uF 100V 1210(3225)  [CAPC1210(3225)280_N]  (value not drawn)
C43  CAP 10uF 100V 1210(3225)  [CAPC1210(3225)280_N]  (value not drawn)
C44  CAP 10uF 100V 1210(3225)  [CAPC1210(3225)280_N]  (value not drawn)
C46  CAP 10uF 100V 1210(3225)  [CAPC1210(3225)280_N]  (value not drawn)
C51  220nF  [CAP 0603/1608]
C57  CAP 10uF 100V 1210(3225)  [CAPC1210(3225)280_N]  (value not drawn)
C58  CAP 10uF 100V 1210(3225)  [CAPC1210(3225)280_N]  (value not drawn)
C59  10uF  [CAPC1206(3216)190_M]
D4  PMEG6020AELR  [SOD123W]
H2  Hole  [M2-HOLE]
L2  22uH  [74438335220]
Q1  NTMFS5C604NLT1G  [DFN500X600X110-5N]  (value not drawn)
Q2  NTMFS5C604NLT1G  [DFN500X600X110-5N]  (value not drawn)
Q3  NTMFS5C604NLT1G  [DFN500X600X110-5N]  (value not drawn)
Q4  NTMFS5C604NLT1G  [DFN500X600X110-5N]  (value not drawn)
Q5  NTMFS5C604NLT1G  [DFN500X600X110-5N]  (value not drawn)
Q6  NTMFS5C604NLT1G  [DFN500X600X110-5N]  (value not drawn)
R14  39k  [RES 0603/1608]
R15  2k2  [RES 0603/1608]
R16  4.7R  [RES 0603/1608]
R17  4.7R  [RES 0603/1608]
R18  100R  [RES 0603/1608]
R19  100R  [RES 0603/1608]
R20  100R  [RES 0603/1608]
R21  2mOhm  [CSS2H-2512K-2L00F]
R22  10K  [RES 0603/1608]
R23  39k  [RES 0603/1608]
R24  2k2  [RES 0603/1608]
R25  4.7R  [RES 0603/1608]
R26  4.7R  [RES 0603/1608]
R27  2mOhm  [CSS2H-2512K-2L00F]
R28  39k  [RES 0603/1608]
R29  2k2  [RES 0603/1608]
R30  4.7R  [RES 0603/1608]
R31  4.7R  [RES 0603/1608]
R32  10K  [RES 0603/1608]
R33  2mOhm  [CSS2H-2512K-2L00F]
R34  54K9  [RESC0603(1608)_M]
R35  10K  [RES 0603/1608]
R36  NTC 10k  [RES 0402/1005]
R37  10K  [RES 0603/1608]
R38  39k  [RES 0603/1608]
R44  2k2  [RES 0603/1608]
U3  DRV8323RSRGZR  [VQFN-48_N]

### Ports
CAL, CURR_A, CURR_B, CURR_C, EN_GATE, INH_A, INH_B, INH_C, INL_A, INL_B, INL_C, nFAULT, nSCS, SCLK, SDI, SDO, SENS_A, SENS_B, SENS_C, SENS_SUPPLY, TEMP_MOSFET, U, V, V_SUPPLY, W

### Nets
5V: C59.2 L2.2 R34.2  [project net MOSI]
GND: C9.1 C12.2 C15.2 C19.2 C22.1 C25.2 C26.2 C32.1 C33.2 C34.2 C35.2 C37.1 C40.2 C41.2 C42.2 C43.2 C44.2 C46.2 C59.1 D4.2(A) R15.1 R21.2 R24.1 R27.2 R29.1 R33.2 R35.2 R37.2 R44.2 U3.2(PGND) U3.27(DGND) U3.35(AGND) U3.43(BGND) U3.49(GND_(PowerPAD))
SUPPLY: C9.2 C18.2 C20.1 C21.1 C22.2 C25.1 C33.1 C34.1 C35.1 C36.1 C39.1 C40.1 C41.1 C42.1 C43.1 C44.1 C46.1 C57.1 C58.1 Q1.5_6(D) Q1.5_6_1(D) Q1.5_6_2(D) Q1.5_6_3(D) Q1.5_6_4(D) Q3.5_6(D) Q3.5_6_1(D) Q3.5_6_2(D) Q3.5_6_3(D) Q3.5_6_4(D) Q5.5_6(D) Q5.5_6_1(D) Q5.5_6_2(D) Q5.5_6_3(D) Q5.5_6_4(D) R38.2 U3.6(VM) U3.7(VDRAIN) U3.47(VIN) ; port V_SUPPLY  [project net V_SUPPLY]
VCC: C26.1 R22.1 R32.1 R36.2 U3.26(VREF)
AN_IN: R38.1 R44.1 ; port SENS_SUPPLY
CAL: U3.34(CAL) ; port CAL
CURRENT_1: C12.1 R18.2 ; port CURR_A
CURRENT_2: C15.1 R19.2 ; port CURR_B
CURRENT_3: C19.1 R20.2 ; port CURR_C
EN_GATE: U3.33(ENABLE) ; port EN_GATE
GHA: R16.1 U3.8(GHA)
GHB: R25.1 U3.17(GHB)
GHC: R30.1 U3.18(GHC)
GLA: R17.1 U3.10(GLA)
GLB: R26.1 U3.15(GLB)
GLC: R31.1 U3.20(GLC)
H1: U3.37(INHA) ; port INH_A
H2: U3.39(INHB) ; port INH_B
H3: U3.41(INHC) ; port INH_C
ISEN_A: R18.1 U3.25(SOA)
ISEN_B: R19.1 U3.24(SOB)
ISEN_C: R20.1 U3.23(SOC)
L1: U3.38(INLA) ; port INL_A
L2: U3.40(INLB) ; port INL_B
L3: U3.42(INLC) ; port INL_C
nFAULT: R32.2 U3.28(nFAULT) ; port nFAULT
SHA: Q1.1(S) Q1.2(S) Q1.3(S) Q2.5_6(D) Q2.5_6_1(D) Q2.5_6_2(D) Q2.5_6_3(D) Q2.5_6_4(D) R14.2 U3.9(SHA) ; port U
SHB: Q3.1(S) Q3.2(S) Q3.3(S) Q4.5_6(D) Q4.5_6_1(D) Q4.5_6_2(D) Q4.5_6_3(D) Q4.5_6_4(D) R23.2 U3.16(SHB) ; port V
SHC: Q5.1(S) Q5.2(S) Q5.3(S) Q6.5_6(D) Q6.5_6_1(D) Q6.5_6_2(D) Q6.5_6_3(D) Q6.5_6_4(D) R28.2 U3.19(SHC) ; port W
SNA: R21.4 U3.12(SNA)
SNB: R27.4 U3.13(SNB)
SNC: R33.4 U3.22(SNC)
SPA: R21.3 U3.11(SPA)
SPB: R27.3 U3.14(SPB)
SPC: R33.3 U3.21(SPC)
SPI3_MISO: R22.2 U3.29(SDO(RS)/MODE(RH)) ; port SDO
SPI3_MOSI: U3.30(SDI(RS)/IDRIVE(RH)) ; port SDI
SPI3_nCS: U3.32(nSCS(RS)/GAIN(RH)) ; port nSCS
SPI3_SCK: U3.31(SCLK(RS)/VDS(RH)) ; port SCLK
TEMP_MOSFET: C37.2 R35.1 R36.1 ; port TEMP_MOSFET
VOLTAGE_1: R14.1 R15.2 ; port SENS_A
VOLTAGE_2: R23.1 R24.2 ; port SENS_B
VOLTAGE_3: R28.1 R29.2 ; port SENS_C
NetC18_1: C18.1 U3.5(VCP)
NetC20_2: C20.2 C21.2 Q2.1(S) Q2.2(S) Q2.3(S) R21.1
NetC31_1: C31.1 U3.3(CPL)
NetC31_2: C31.2 U3.4(CPH)
NetC32_2: C32.2 U3.36(DVDD)
NetC36_2: C36.2 C39.2 Q4.1(S) Q4.2(S) Q4.3(S) R27.1
NetC51_1: C51.1 D4.1(K) L2.1 U3.45(SW)
NetC51_2: C51.2 U3.44(CB)
NetC57_2: C57.2 C58.2 Q6.1(S) Q6.2(S) Q6.3(S) R33.1
NetQ1_4: Q1.4(G) R16.2
NetQ2_4: Q2.4(G) R17.2
NetQ3_4: Q3.4(G) R25.2
NetQ4_4: Q4.4(G) R26.2
NetQ5_4: Q5.4(G) R30.2
NetQ6_4: Q6.4(G) R31.2
NetR34_1: R34.1 R37.1 U3.1(FB)

Not connected (* = marked no-connect by the designer): H2 0*; U3 46(NC) 48(nSHDN)*

### Notes on the sheet
- 10uF 1210(3225) 100V * 10EA = 100uF 100V
- Title
- Size:
- Date:
- A3
- Number:
- Time:
- Revision:
- Sheet
- Author:
- of
- File:

### Library data of the parts
C9 = CAP: Multilayer Ceramic Capacitors MLCC - SMD/SMT 0603 0.1uF 100volts X7R 10%; Manufacturer: Murata; PartNumber: GCJ188R72A104KA01D
C12 C15 C19 = GRM1885C1H222JA01D: as C50 on sheet can
C18 = CAP: Multilayer Ceramic Capacitors MLCC - SMD/SMT 1.0UF 100V 10% 0805; Manufacturer: Murata; PartNumber: GRM21BC72A105KE01L
C20 C21 C25 C33-C36 C39-C44 C46 C57 C58 = CMP-1038-02106-1: 100Vdc 10uF 10% 1210/2502; PartNumber: GRM32EC72A106KE05L; Case-EIA: 1210; Case-Metric: 3225; Tolerance: Â±20%; Technology: SMT; Value: 10uF; Max Thickness: 2.8 mm; Rated Voltage: 100 V
C22 = CAP: Multilayer Ceramic Capacitors MLCC - SMD/SMT 1.0UF 100V 10% 0805; Manufacturer: Murata; Part Number: GRM21BC72A105KE01L
C26 = GRM188R71E104KA01D: as C1 on sheet mcu; Supplier 1: Digi-Key; Supplier Part Number 1: 490-1524-1-ND; Manufacturer Part Number: GRM188R71E104KA01D; RoHS: RoHS Compliant; Category: Capacitors; Stock 1: 1667481; Pricing 1: 1=0.1, 10=0.019, 50=0.0104, 100=0.0088, 250=0.0072, 500=0.00616, 1000=0.0048 (USD); Packaging: Cut Tape (CT); Capacitance: 0.10µF; Voltage - Rated: 25V; Temperature Coefficient: X7R; Mounting Type: Surface Mount, MLCC; Operating Temperature: -55°C ~ 125°C; Applications: General Purpose; Ratings: -; Package / Case: 0603 (1608 Metric); Size / Dimension: 0.063" L x 0.031" W (1.60mm x 0.80mm); Height - Seated (Max): -; Thickness (Max): 0.035" (0.90mm); Lead Spacing: -; Features: -; Lead Style: -; ComponentLink1URL: http://www.murata.com/~/media/webrenewal/support/library/catalog/products/capacitor/mlcc/c02e.pdf; ComponentLink1Description: http://www.murata.com/~/media/webrenewal/support/library/catalog/products/capacitor/mlcc/c02e.pdf; PartNumber: GRM188R71E104KA01D
C31 = CMP-1035-02502-1: CAP 47nF 16V ±5% 0603 (1608 Metric) Thickness 1mm SMD; PartNumber: CC0603KRX7R7BB473; Tolerance: Â±10%; Case-Metric: 1608; Case-EIA: 0603; Value: 47nF; Technology: SMT; Rated Voltage: 16 V; Max Thickness: 1 mm
C32 = CMP-1035-02730-1: as C6 on sheet mcu; Rated Voltage: 6.3 V; Max Thickness: 1 mm; Technology: SMT; Value: 1uF
C37 = GRM188R61C225KE15D: as C10 on sheet mcu; Supplier 1: Digi-Key; Supplier Part Number 1: 490-3296-1-ND; Manufacturer Part Number: GRM188R61C225KE15D; RoHS: RoHS Compliant; Category: Capacitors; Stock 1: 1255740; Pricing 1: 1=0.12, 10=0.08, 50=0.046, 100=0.038, 250=0.032, 500=0.0268, 1000=0.022 (USD); Packaging: Cut Tape (CT); Capacitance: 2.2µF; Voltage - Rated: 16V; Temperature Coefficient: X5R; Mounting Type: Surface Mount, MLCC; Operating Temperature: -55°C ~ 85°C; Applications: General Purpose; Ratings: -; Package / Case: 0603 (1608 Metric); Size / Dimension: 0.063" L x 0.031" W (1.60mm x 0.80mm); Height - Seated (Max): -; Thickness (Max): 0.035" (0.90mm); Lead Spacing: -; Features: -; Lead Style: -; ComponentLink1URL: http://www.murata.com/~/media/webrenewal/support/library/catalog/products/capacitor/mlcc/c02e.pdf; ComponentLink1Description: http://www.murata.com/~/media/webrenewal/support/library/catalog/products/capacitor/mlcc/c02e.pdf; PartNumber: GRM188R61C225KE15D
C51 = GRM188R71E104KA01D: CAP CER 220nF 50V X7R 0603; PartNumber: GRM188R71H224KAC4J
C59 = CGA5L1X8L1C106K160AC: Multilayer Ceramic Capacitors MLCC - SMD/SMT 16V 10uF 10% 1.60mm X8L AEC-Q200; PartNumber: CGA5L1X8L1C106K160AC
D4 = PMEG6020AELR: 60 V, 2 A low leakage current Schottky barrier rectifier; PartNumber: PMEG6020AELR
H2 = Hole: M2, M2.5, M3 Hole
L2 = 74438335220: Fixed Inductors WE-MAPI SMD 3015 22uH 0.60A 1040mOhm; PartNumber: 74438335220
Q1-Q6 = NTMFS5C604NLT1G: Power MOSFET / 60 V, 1.2 m, 287 A, Single N−Channel; Manufacturer: International Rectifier; Power Dissipation @ TC: 25C (W)=380; VGs Max(V): 16; ID @ TC: 100C (A)=210; Tj Max: 175; Packing: Tube; Circuit: Discrete; RDS(on) Max 4.5V (mOhms): 2.2; Rth(JC) (C/W): 0.40; RDS(on) Max 10V (mOhms): 1.9; Qg Typ (nC): 110.0; Qgd Typ (nC): 53.0; ComponentLink1URL: http://www.irf.com/; ComponentLink1Description: Manufacturer URL; ComponentLink3Description: Package Specification; ComponentLink2Description: Datasheet; Mounting Technology: Surface Mount; PackageReference: D2PAK-7; DatasheetVersion: Oct-10; PackageDescription: 7-Pin Long Leads Package Outline, Body 10.16 x 9.015 mm, Pitch 1.27 mm; ComponentLink3URL: http://ec.irf.com/v6/en/US/adirect/ir?cmd=catSearchFrame&domSendTo=byID&domProductQueryName=IRLS3036-7PPbF; ComponentLink2URL: http://www.irf.com/product-info/datasheets/data/irls3036-7ppbf.pdf; PartNumber: NTMFS5C604NLT1G
R14 R23 R28 R38 = Res3: RES SMD 39K OHM 1% 1/10W 0603; PartNumber: RC0603FR-0739KL; Published: 8-Jun-2000; LatestRevisionDate: 29-May-2009; LatestRevisionNote: IPC-7351 Footprint Added.; PackageReference: J1-0603; Publisher: Altium Limited; PackageDescription: Chip Resistor; Value: 39k
R15 R24 R29 R44 = Res3: RES SMD 2.2K OHM 1% 1/10W 0603; PartNumber: RC0603FR-072K2L; Published: 8-Jun-2000; LatestRevisionDate: 29-May-2009; LatestRevisionNote: IPC-7351 Footprint Added.; PackageReference: J1-0603; Publisher: Altium Limited; PackageDescription: Chip Resistor; Value: 2k2
R16 R17 R25 R26 R30 R31 = RC0603FR-072RL: 4.7R 0.1W 1% 0603 (1608 Metric)  SMD; PartNumber: RC0603FR-074R7L
R18-R20 = RC0603FR-07120RL: RES SMD 100R OHM 1% 1/10W 0603; PartNumber: RC0603JR-07100RL
R21 R27 R33 = CSS2H-2512K-2L00F: Current Sense Resistors - SMD 2mOhms 5W 1% AEC-Q200; PartNumber: CSS2H-2512K-2L00F
R22 R32 R35 R37 = RC0603FR-0710KL: as R7 on sheet mcu; Supplier 1: Digi-Key; Supplier Part Number 1: 311-10.0KHRCT-ND; Manufacturer Part Number: RC0603FR-0710KL; RoHS: RoHS Compliant; Category: Resistors; Stock 1: 13504930; Pricing 1: 1=0.1, 10=0.014, 25=0.01, 100=0.0057, 250=0.00436, 500=0.00348, 1000=0.00257, 2500=0.00223 (USD); Packaging: Cut Tape (CT); Resistance (Ohms): 10k; Tolerance: ±1%; Composition: Thick Film; Features: Moisture Resistant; Operating Temperature: -55°C ~ 155°C; Package / Case: 0603 (1608 Metric); Supplier Device Package: 0603; Size / Dimension: 0.063" L x 0.031" W (1.60mm x 0.80mm); Height: 0.022" (0.55mm); Number of Terminations: 2; ComponentLink1URL: http://www.yageo.com/documents/recent/PYu-RC_Group_51_RoHS_L_04.pdf; ComponentLink1Description: http://www.yageo.com/documents/recent/PYu-RC_Group_51_RoHS_L_04.pdf; PartNumber: RC0603FR-0710KL
R34 = CMP-1012-00707-1: 54K9 0.1W 1% 0603 (1608 Metric)  SMD; PartNumber: RC0603FR-0754K9L; Case-EIA: 0603; Case-Metric: 1608; Value: 54900.00 Ohm; Technology: SMT; Tolerance: 1 %; Power: 0.1 W
R36 = NCP15XH103F03RC: THERMISTOR 10K OHM NTC 0402 SMD; PartNumber: NCP15XH103F03RC
U3 = DRV8323RSRGZR: Gate Drivers 60V Three-Phase Smart Gate Driver With Buck Regulator and Three Current Shunt Amplifiers 48-VQFN -40 to 125; PartNumber: DRV8323RSRGZR

## Nets that join several sheets
GND: mcu (34 pins), can (9 pins), driver (34 pins)
MOSI: mcu (5 pins), driver (C59.2 L2.2 R34.2)
V_SUPPLY: mcu (J3.1), driver (38 pins)
VCC: mcu (18 pins), can (C47.2 S1.1 U11.3 U12.8), driver (5 pins)
AN_IN: mcu (U2.11), driver (R38.1 R44.1)
CAL: mcu (U2.2), driver (U3.34)
CAN_N: mcu (J7.2 J9.2), can (C49.1 T1.2 U12.6)
CAN_P: mcu (J7.1 J9.1), can (C48.2 T1.3 U12.10)
CAN_RX: mcu (U2.61), can (U11.4)
CAN_TX: mcu (U2.62), can (U11.1)
CURRENT_1: mcu (U2.8), driver (C12.1 R18.2)
CURRENT_2: mcu (U2.9), driver (C15.1 R19.2)
CURRENT_3: mcu (U2.10), driver (C19.1 R20.2)
EN_GATE: mcu (U2.57), driver (U3.33)
H1: mcu (U2.41), driver (U3.37)
H2: mcu (U2.42), driver (U3.39)
H3: mcu (U2.43), driver (U3.41)
L1: mcu (U2.34), driver (U3.38)
L2: mcu (U2.35), driver (U3.40)
L3: mcu (U2.36), driver (U3.42)
nFAULT: mcu (U2.59), driver (R32.2 U3.28)
SHA: mcu (J2.1), driver (10 pins)
SHB: mcu (J2.2), driver (10 pins)
SHC: mcu (J2.3), driver (10 pins)
SPI3_MISO: mcu (U2.52), driver (R22.2 U3.29)
SPI3_MOSI: mcu (U2.53), driver (U3.30)
SPI3_nCS: mcu (U2.40), driver (U3.32)
SPI3_SCK: mcu (U2.51), driver (U3.31)
TEMP_MOSFET: mcu (U2.17), driver (C37.2 R35.1 R36.1)
VOLTAGE_1: mcu (U2.14), driver (R14.1 R15.2)
VOLTAGE_2: mcu (U2.15), driver (R23.1 R24.2)
VOLTAGE_3: mcu (U2.16), driver (R28.1 R29.2)